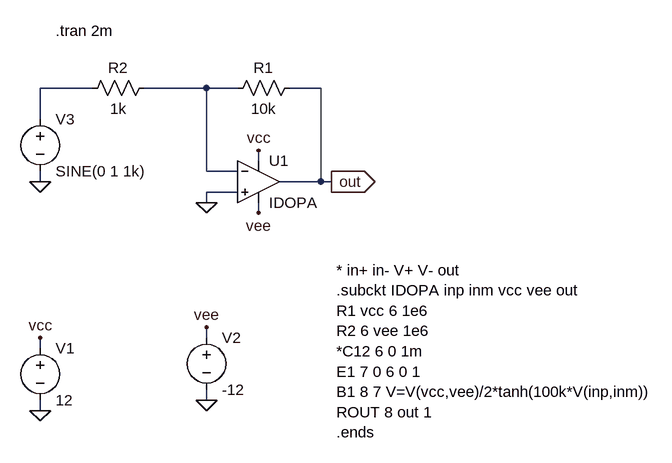
[diagram p0: schematic ideal_opa1.asc]
ideal_opa1.asc, the LTspice schematic file:
Version 4
SHEET 1 880 680
WIRE -80 -96 -160 -96
WIRE 96 -96 0 -96
WIRE 144 -96 96 -96
WIRE 272 -96 224 -96
WIRE -160 -48 -160 -96
WIRE 176 16 176 0
WIRE 96 32 96 -96
WIRE 144 32 96 32
WIRE -160 48 -160 32
WIRE 272 48 272 -96
WIRE 272 48 208 48
WIRE 288 48 272 48
WIRE 144 64 96 64
WIRE 96 80 96 64
WIRE 176 96 176 80
WIRE 96 288 96 272
WIRE -160 304 -160 288
WIRE 96 384 96 368
WIRE -160 400 -160 384
FLAG 96 80 0
FLAG -160 48 0
FLAG 176 0 vcc
FLAG 176 96 vee
FLAG -160 400 0
FLAG 96 384 0
FLAG -160 288 vcc
FLAG 96 272 vee
FLAG 288 48 out
IOPIN 288 48 Out
SYMBOL Opamps\\opamp2 176 -16 R0
SYMATTR InstName U1
SYMATTR Value IDOPA
SYMBOL res 128 -80 R270
WINDOW 0 32 56 VTop 0
WINDOW 3 0 56 VBottom 0
SYMATTR InstName R1
SYMATTR Value 10k
SYMBOL res -96 -80 R270
WINDOW 0 32 56 VTop 0
WINDOW 3 0 56 VBottom 0
SYMATTR InstName R2
SYMATTR Value 1k
SYMBOL voltage -160 288 R0
WINDOW 123 0 0 Left 0
WINDOW 39 0 0 Left 0
SYMATTR InstName V1
SYMATTR Value 12
SYMBOL voltage 96 272 R0
SYMATTR InstName V2
SYMATTR Value -12
SYMBOL voltage -160 -64 R0
WINDOW 123 0 0 Left 0
WINDOW 39 0 0 Left 0
SYMATTR InstName V3
SYMATTR Value SINE(0 1 1k)
TEXT 296 184 Left 0 !* in+ in- V+ V- out\n.subckt IDOPA inp inm vcc vee out\nR1 vcc 6 1e6 \nR2 6 vee 1e6\n*C12 6 0 1m\nE1 7 0 6 0 1\nB1 8 7 V=V(vcc,vee)/2*tanh(100k*V(inp,inm))\nROUT 8 out 1\n.ends
TEXT -136 -184 Left 0 !.tran 2m

The netlist it stands for:
* ideal_opa1.asc
XU1 0 N002 vcc vee out IDOPA  ; pins In+ In- V+ V- OUT
R1 N002 out 10k
R2 N001 N002 1k
V1 vcc 0 12
V2 vee 0 -12
V3 N001 0 SINE(0 1 1k)
* in+ in- V+ V- out
.subckt IDOPA inp inm vcc vee out
R1 vcc 6 1e6
R2 6 vee 1e6
*C12 6 0 1m
E1 7 0 6 0 1
B1 8 7 V=V(vcc,vee)/2*tanh(100k*V(inp,inm))
ROUT 8 out 1
.ends
.tran 2m
.backanno
.end